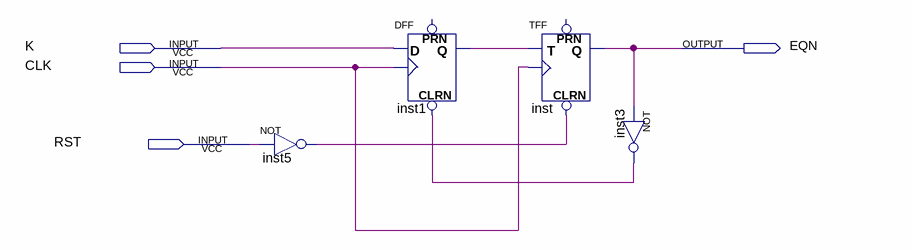
[diagram p0: schematic sheet]
// Quartus schematic eq_checker.bdf as structural Verilog: 4 symbols, 4 pins
module eq_checker (
  input  K,
  input  CLK,
  input  RST,
  output EQN
);

  wire inst1_q, inst3_out, inst5_out;

  not inst5 (inst5_out, RST);
  DFF inst1 (.CLRN(inst3_out), .CLK(CLK), .D(K), .Q(inst1_q));  // open: PRN
  TFF inst (.CLRN(inst5_out), .T(inst1_q), .CLK(CLK), .Q(EQN));  // open: PRN
  not inst3 (inst3_out, EQN);
endmodule
